# Altium schematic sheet GY-521_2023-06-16.schdoc
size 62 x 45 mm
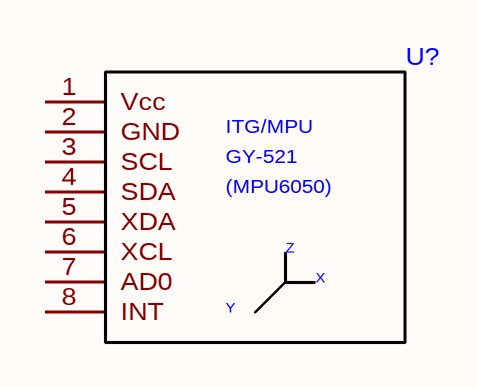
[diagram p0: GY-521_2023-06-16.schdoc]

## Parts
U?  (no value)  [GY-521]

## Nets

Not connected (* = marked no-connect by the designer): U? 1(Vcc) 2(GND) 3(SCL) 4(SDA) 5(XDA) 6(XCL) 7(AD0) 8(INT)

## Notes on the sheet
- (in symbol GY-521) ITG/MPU; (MPU6050); Z; X; Y

## Library data of the parts
U? = GY-521